# Altium schematic sheet keyboard.SchDoc: FPGA-based Sudoku - keyboard
size B; Author: Justin Silver; DocumentNumber: 1; Revision: v1.0; SheetNumber: 1; SheetTotal: 4
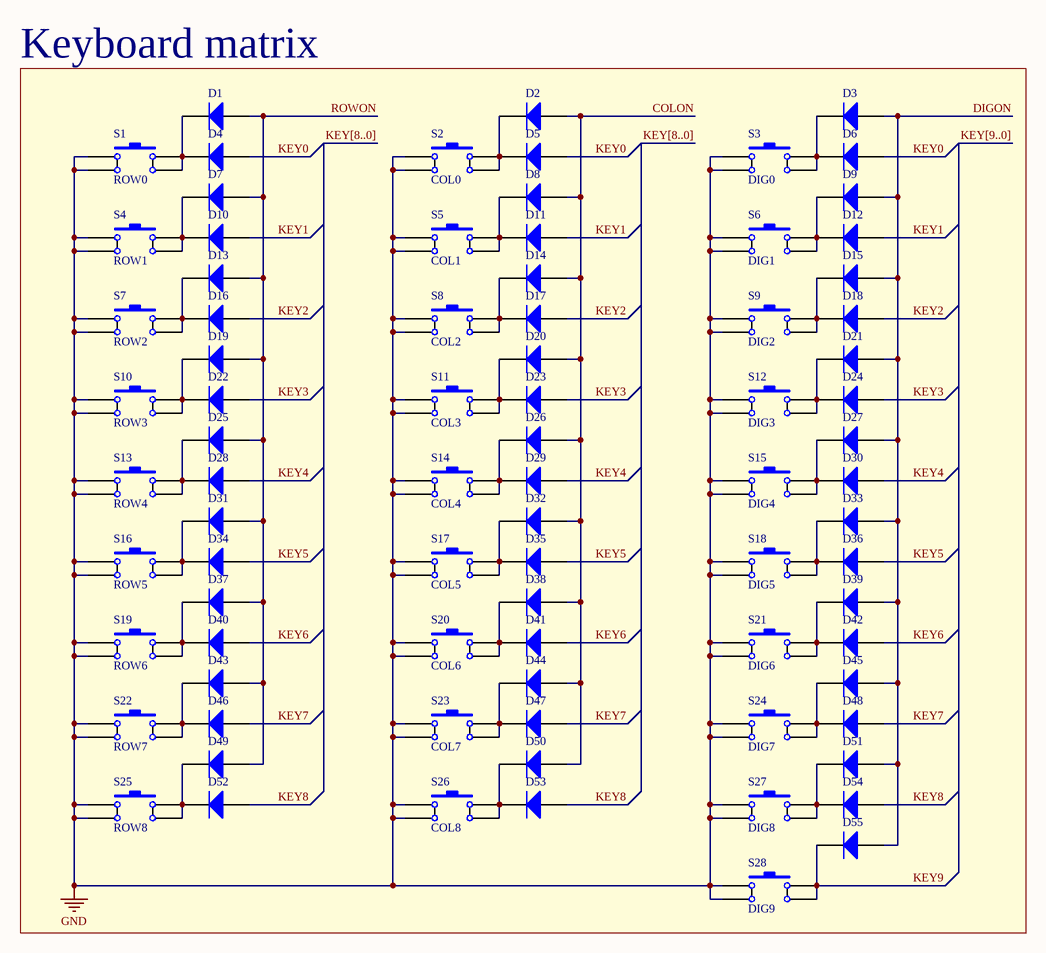
[diagram p0: keyboard.SchDoc]

## Parts
D1  Diode 1N4007  [DIODE_SMC]  (value not drawn)
D2  Diode 1N4007  [DIODE_SMC]  (value not drawn)
D3  Diode 1N4007  [DIODE_SMC]  (value not drawn)
D4  Diode 1N4007  [DIODE_SMC]  (value not drawn)
D5  Diode 1N4007  [DIODE_SMC]  (value not drawn)
D6  Diode 1N4007  [DIODE_SMC]  (value not drawn)
D7  Diode 1N4007  [DIODE_SMC]  (value not drawn)
D8  Diode 1N4007  [DIODE_SMC]  (value not drawn)
D9  Diode 1N4007  [DIODE_SMC]  (value not drawn)
D10  Diode 1N4007  [DIODE_SMC]  (value not drawn)
D11  Diode 1N4007  [DIODE_SMC]  (value not drawn)
D12  Diode 1N4007  [DIODE_SMC]  (value not drawn)
D13  Diode 1N4007  [DIODE_SMC]  (value not drawn)
D14  Diode 1N4007  [DIODE_SMC]  (value not drawn)
D15  Diode 1N4007  [DIODE_SMC]  (value not drawn)
D16  Diode 1N4007  [DIODE_SMC]  (value not drawn)
D17  Diode 1N4007  [DIODE_SMC]  (value not drawn)
D18  Diode 1N4007  [DIODE_SMC]  (value not drawn)
D19  Diode 1N4007  [DIODE_SMC]  (value not drawn)
D20  Diode 1N4007  [DIODE_SMC]  (value not drawn)
D21  Diode 1N4007  [DIODE_SMC]  (value not drawn)
D22  Diode 1N4007  [DIODE_SMC]  (value not drawn)
D23  Diode 1N4007  [DIODE_SMC]  (value not drawn)
D24  Diode 1N4007  [DIODE_SMC]  (value not drawn)
D25  Diode 1N4007  [DIODE_SMC]  (value not drawn)
D26  Diode 1N4007  [DIODE_SMC]  (value not drawn)
D27  Diode 1N4007  [DIODE_SMC]  (value not drawn)
D28  Diode 1N4007  [DIODE_SMC]  (value not drawn)
D29  Diode 1N4007  [DIODE_SMC]  (value not drawn)
D30  Diode 1N4007  [DIODE_SMC]  (value not drawn)
D31  Diode 1N4007  [DIODE_SMC]  (value not drawn)
D32  Diode 1N4007  [DIODE_SMC]  (value not drawn)
D33  Diode 1N4007  [DIODE_SMC]  (value not drawn)
D34  Diode 1N4007  [DIODE_SMC]  (value not drawn)
D35  Diode 1N4007  [DIODE_SMC]  (value not drawn)
D36  Diode 1N4007  [DIODE_SMC]  (value not drawn)
D37  Diode 1N4007  [DIODE_SMC]  (value not drawn)
D38  Diode 1N4007  [DIODE_SMC]  (value not drawn)
D39  Diode 1N4007  [DIODE_SMC]  (value not drawn)
D40  Diode 1N4007  [DIODE_SMC]  (value not drawn)
D41  Diode 1N4007  [DIODE_SMC]  (value not drawn)
D42  Diode 1N4007  [DIODE_SMC]  (value not drawn)
D43  Diode 1N4007  [DIODE_SMC]  (value not drawn)
D44  Diode 1N4007  [DIODE_SMC]  (value not drawn)
D45  Diode 1N4007  [DIODE_SMC]  (value not drawn)
D46  Diode 1N4007  [DIODE_SMC]  (value not drawn)
D47  Diode 1N4007  [DIODE_SMC]  (value not drawn)
D48  Diode 1N4007  [DIODE_SMC]  (value not drawn)
D49  Diode 1N4007  [DIODE_SMC]  (value not drawn)
D50  Diode 1N4007  [DIODE_SMC]  (value not drawn)
D51  Diode 1N4007  [DIODE_SMC]  (value not drawn)
D52  Diode 1N4007  [DIODE_SMC]  (value not drawn)
D53  Diode 1N4007  [DIODE_SMC]  (value not drawn)
D54  Diode 1N4007  [DIODE_SMC]  (value not drawn)
D55  Diode 1N4007  [DIODE_SMC]  (value not drawn)
S1  ROW0  [SW_1825910-6-4]
S2  COL0  [SW_1825910-6-4]
S3  DIG0  [SW_1825910-6-4]
S4  ROW1  [SW_1825910-6-4]
S5  COL1  [SW_1825910-6-4]
S6  DIG1  [SW_1825910-6-4]
S7  ROW2  [SW_1825910-6-4]
S8  COL2  [SW_1825910-6-4]
S9  DIG2  [SW_1825910-6-4]
S10  ROW3  [SW_1825910-6-4]
S11  COL3  [SW_1825910-6-4]
S12  DIG3  [SW_1825910-6-4]
S13  ROW4  [SW_1825910-6-4]
S14  COL4  [SW_1825910-6-4]
S15  DIG4  [SW_1825910-6-4]
S16  ROW5  [SW_1825910-6-4]
S17  COL5  [SW_1825910-6-4]
S18  DIG5  [SW_1825910-6-4]
S19  ROW6  [SW_1825910-6-4]
S20  COL6  [SW_1825910-6-4]
S21  DIG6  [SW_1825910-6-4]
S22  ROW7  [SW_1825910-6-4]
S23  COL7  [SW_1825910-6-4]
S24  DIG7  [SW_1825910-6-4]
S25  ROW8  [SW_1825910-6-4]
S26  COL8  [SW_1825910-6-4]
S27  DIG8  [SW_1825910-6-4]
S28  DIG9  [SW_1825910-6-4]

## Blocks framed on the sheet
Keyboard matrix: D1-D55 S1-S28

## Nets
GND: S1.3 S1.4 S2.3 S2.4 S3.3 S3.4 S4.3 S4.4 S5.3 S5.4 S6.3 S6.4 S7.3 S7.4 S8.3 S8.4 S9.3 S9.4 S10.3 S10.4 S11.3 S11.4 S12.3 S12.4 S13.3 S13.4 S14.3 S14.4 S15.3 S15.4 S16.3 S16.4 S17.3 S17.4 S18.3 S18.4 S19.3 S19.4 S20.3 S20.4 S21.3 S21.4 S22.3 S22.4 S23.3 S23.4 S24.3 S24.4 S25.3 S25.4 S26.3 S26.4 S27.3 S27.4 S28.3 S28.4
COLON: D2.1(A) D8.1(A) D14.1(A) D20.1(A) D26.1(A) D32.1(A) D38.1(A) D44.1(A) D50.1(A)
DIGON: D3.1(A) D9.1(A) D15.1(A) D21.1(A) D27.1(A) D33.1(A) D39.1(A) D45.1(A) D51.1(A) D55.1(A)
KEY0: D4.1(A) D5.1(A) D6.1(A)
KEY1: D10.1(A) D11.1(A) D12.1(A)
KEY2: D16.1(A) D17.1(A) D18.1(A)
KEY3: D22.1(A) D23.1(A) D24.1(A)
KEY4: D28.1(A) D29.1(A) D30.1(A)
KEY5: D34.1(A) D35.1(A) D36.1(A)
KEY6: D40.1(A) D41.1(A) D42.1(A)
KEY7: D46.1(A) D47.1(A) D48.1(A)
KEY8: D52.1(A) D53.1(A) D54.1(A)
KEY9: D55.2(K) S28.1 S28.2
ROWON: D1.1(A) D7.1(A) D13.1(A) D19.1(A) D25.1(A) D31.1(A) D37.1(A) D43.1(A) D49.1(A)
NetD1_2: D1.2(K) D4.2(K) S1.1 S1.2
NetD2_2: D2.2(K) D5.2(K) S2.1 S2.2
NetD3_2: D3.2(K) D6.2(K) S3.1 S3.2
NetD7_2: D7.2(K) D10.2(K) S4.1 S4.2
NetD8_2: D8.2(K) D11.2(K) S5.1 S5.2
NetD9_2: D9.2(K) D12.2(K) S6.1 S6.2
NetD13_2: D13.2(K) D16.2(K) S7.1 S7.2
NetD14_2: D14.2(K) D17.2(K) S8.1 S8.2
NetD15_2: D15.2(K) D18.2(K) S9.1 S9.2
NetD19_2: D19.2(K) D22.2(K) S10.1 S10.2
NetD20_2: D20.2(K) D23.2(K) S11.1 S11.2
NetD21_2: D21.2(K) D24.2(K) S12.1 S12.2
NetD25_2: D25.2(K) D28.2(K) S13.1 S13.2
NetD26_2: D26.2(K) D29.2(K) S14.1 S14.2
NetD27_2: D27.2(K) D30.2(K) S15.1 S15.2
NetD31_2: D31.2(K) D34.2(K) S16.1 S16.2
NetD32_2: D32.2(K) D35.2(K) S17.1 S17.2
NetD33_2: D33.2(K) D36.2(K) S18.1 S18.2
NetD37_2: D37.2(K) D40.2(K) S19.1 S19.2
NetD38_2: D38.2(K) D41.2(K) S20.1 S20.2
NetD39_2: D39.2(K) D42.2(K) S21.1 S21.2
NetD43_2: D43.2(K) D46.2(K) S22.1 S22.2
NetD44_2: D44.2(K) D47.2(K) S23.1 S23.2
NetD45_2: D45.2(K) D48.2(K) S24.1 S24.2
NetD49_2: D49.2(K) D52.2(K) S25.1 S25.2
NetD50_2: D50.2(K) D53.2(K) S26.1 S26.2
NetD51_2: D51.2(K) D54.2(K) S27.1 S27.2

## Buses and harness runs
bus KEY[8..0]
bus KEY[9..0]

## Library data of the parts
D1-D55 = Diode 1N4007: 1 Amp General Purpose Rectifier; Published: 8-Jun-2000; LatestRevisionDate: 17-Jul-2002; LatestRevisionNote: Re-released for DXP Platform.; DatasheetVersion: 1998; PackageVersion: Aug-1999; PackageReference: DO-41; Publisher: Altium Limited; PackageDescription: Diode, Axial; Body 5.2 x 2.7 mm (LxDia. max), Lead Dia. 0.86 mm (max); Code_JEDEC: DO-204-AL; ComponentLink1Description: Manufacturer Link; ComponentLink1URL: http://www.fairchildsemi.com/; ComponentLink2Description: Datasheet; ComponentLink2URL: http://www.fairchildsemi.com/ds/1N%2F1N4001.pdf
S1-S28 = SW-PB: Switch; Published: 24-Mar-1999; LatestRevisionDate: 17-Jul-2002; LatestRevisionNote: Re-released for DXP Platform.; PackageReference: SPST-2; Publisher: Altium Limited; PackageDescription: Switch; 2 Leads